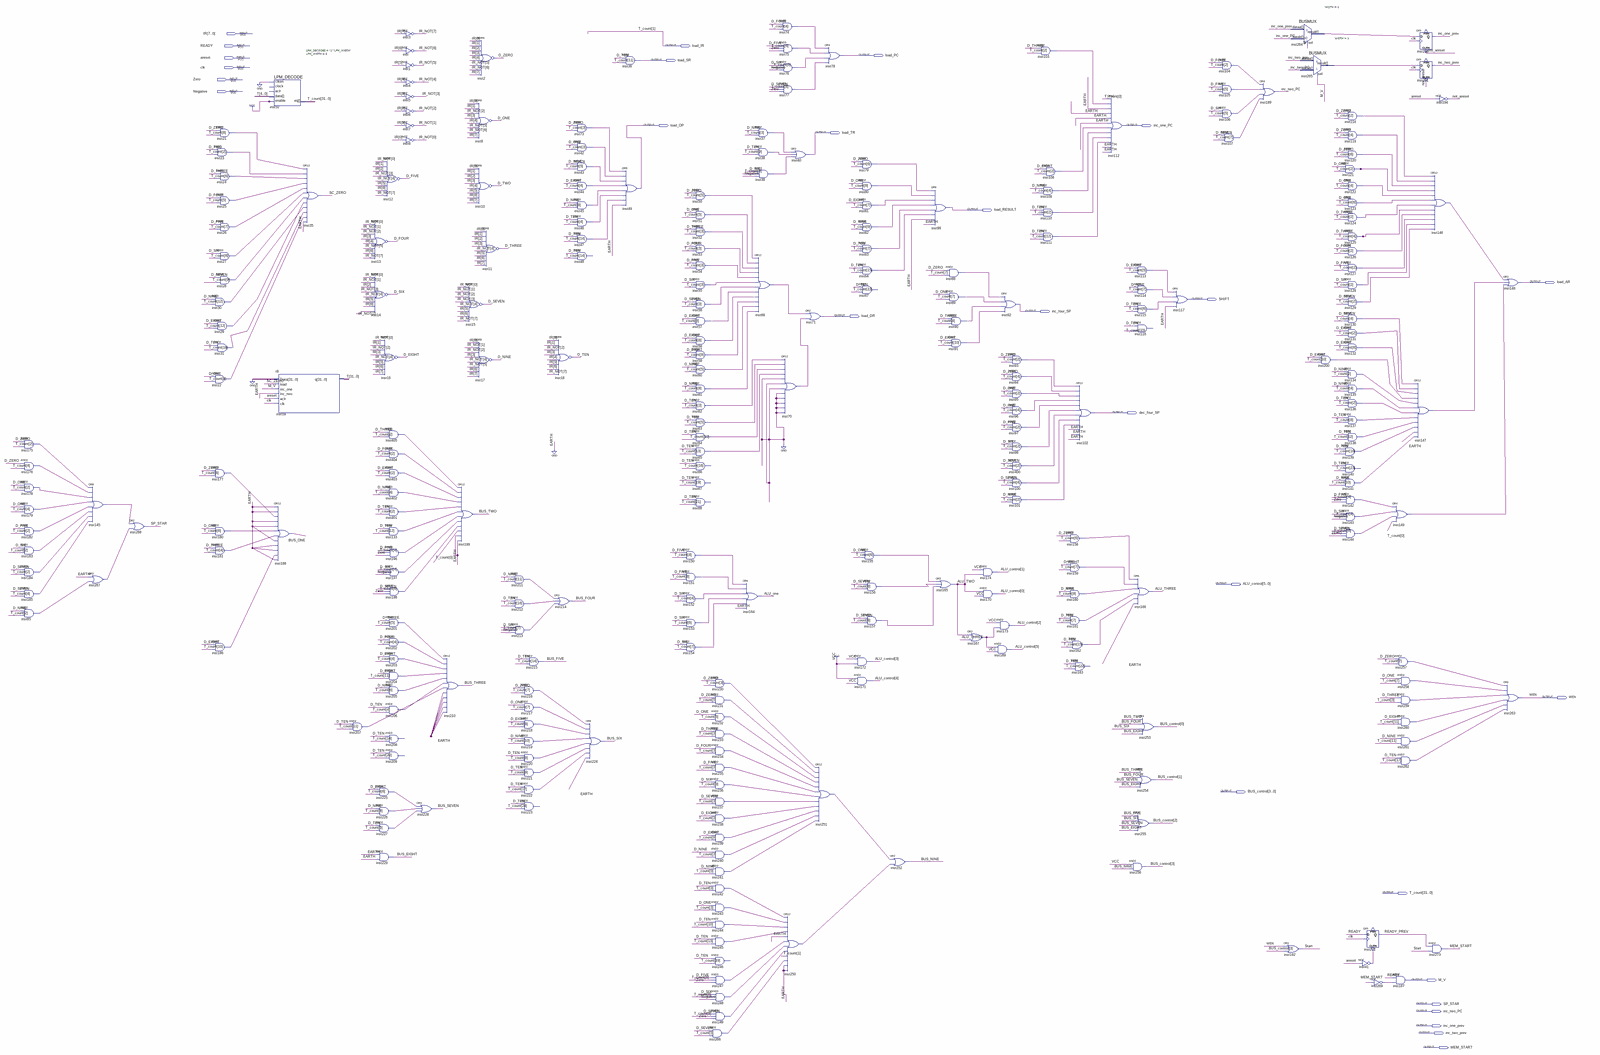
[diagram p0: schematic sheet, whole]
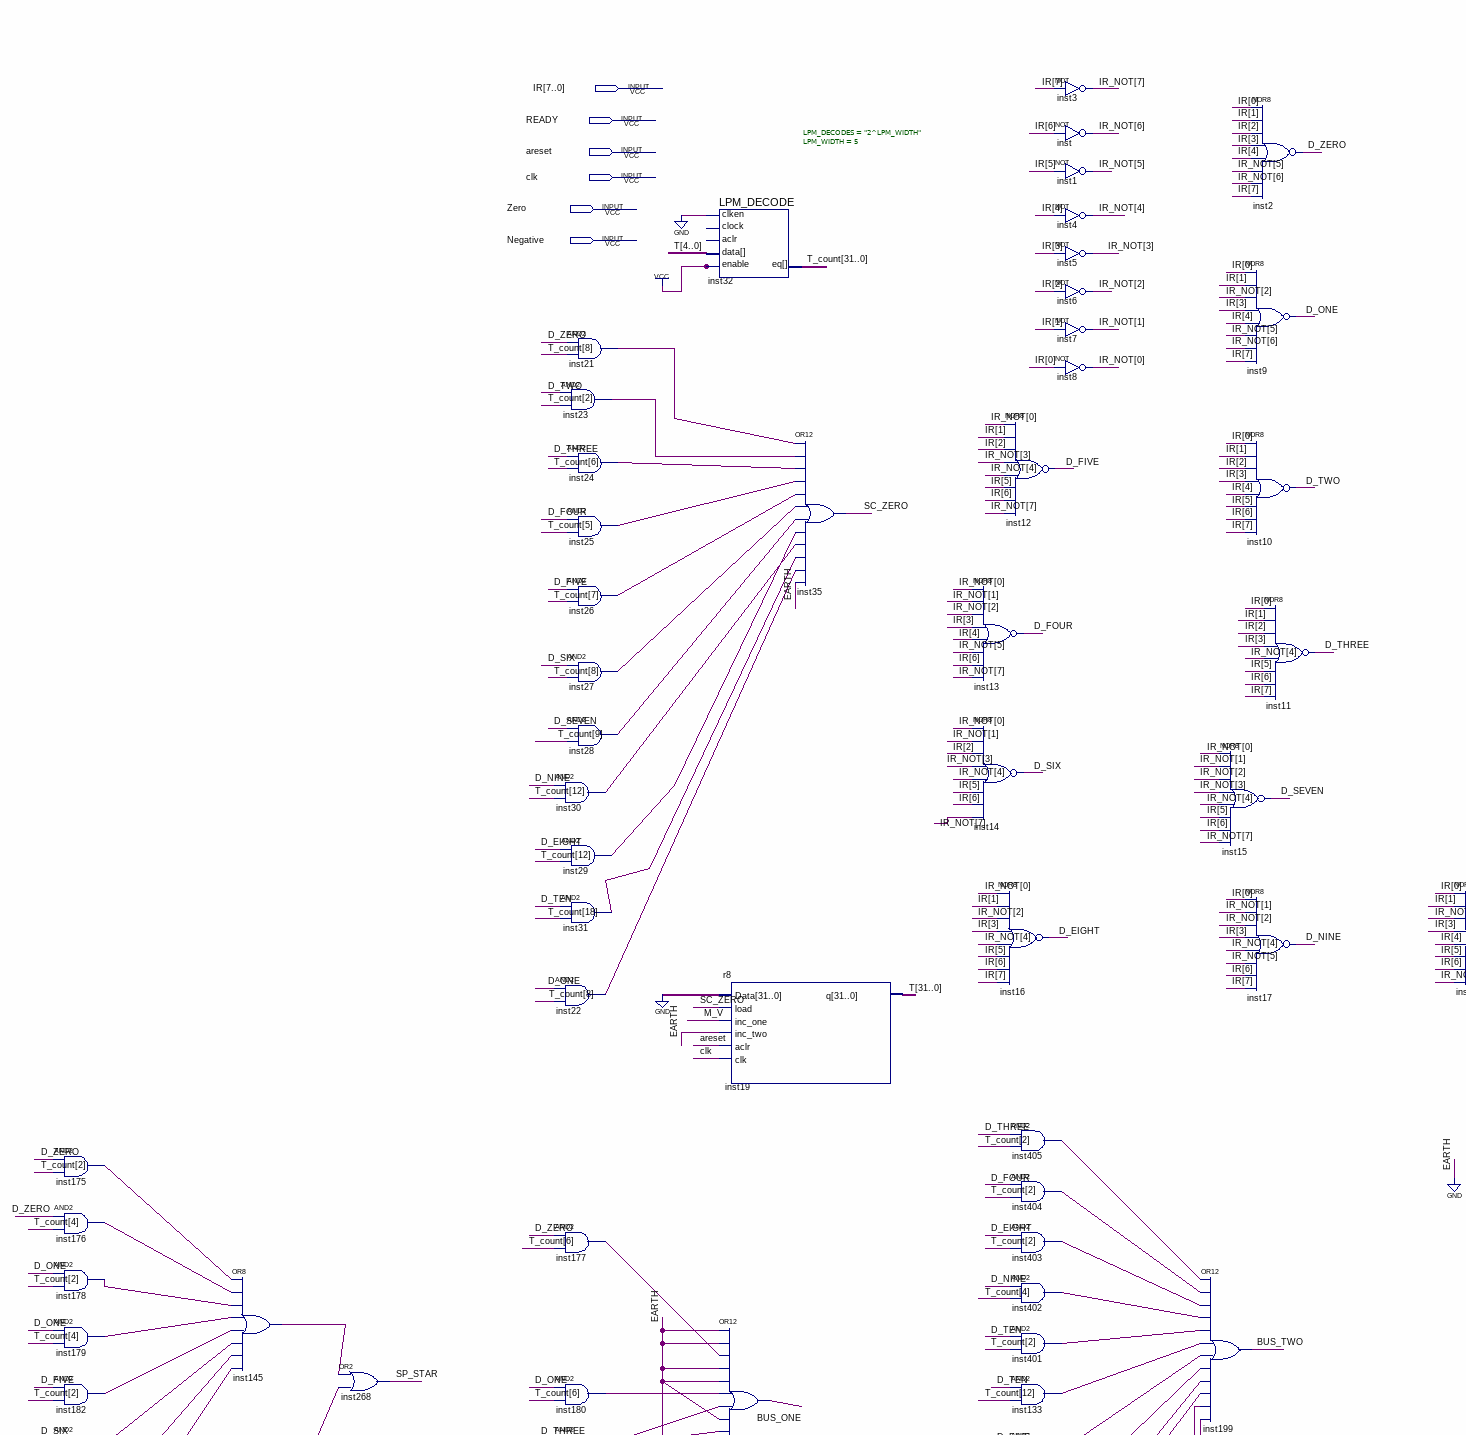
[diagram p1: schematic sheet, upper left part]
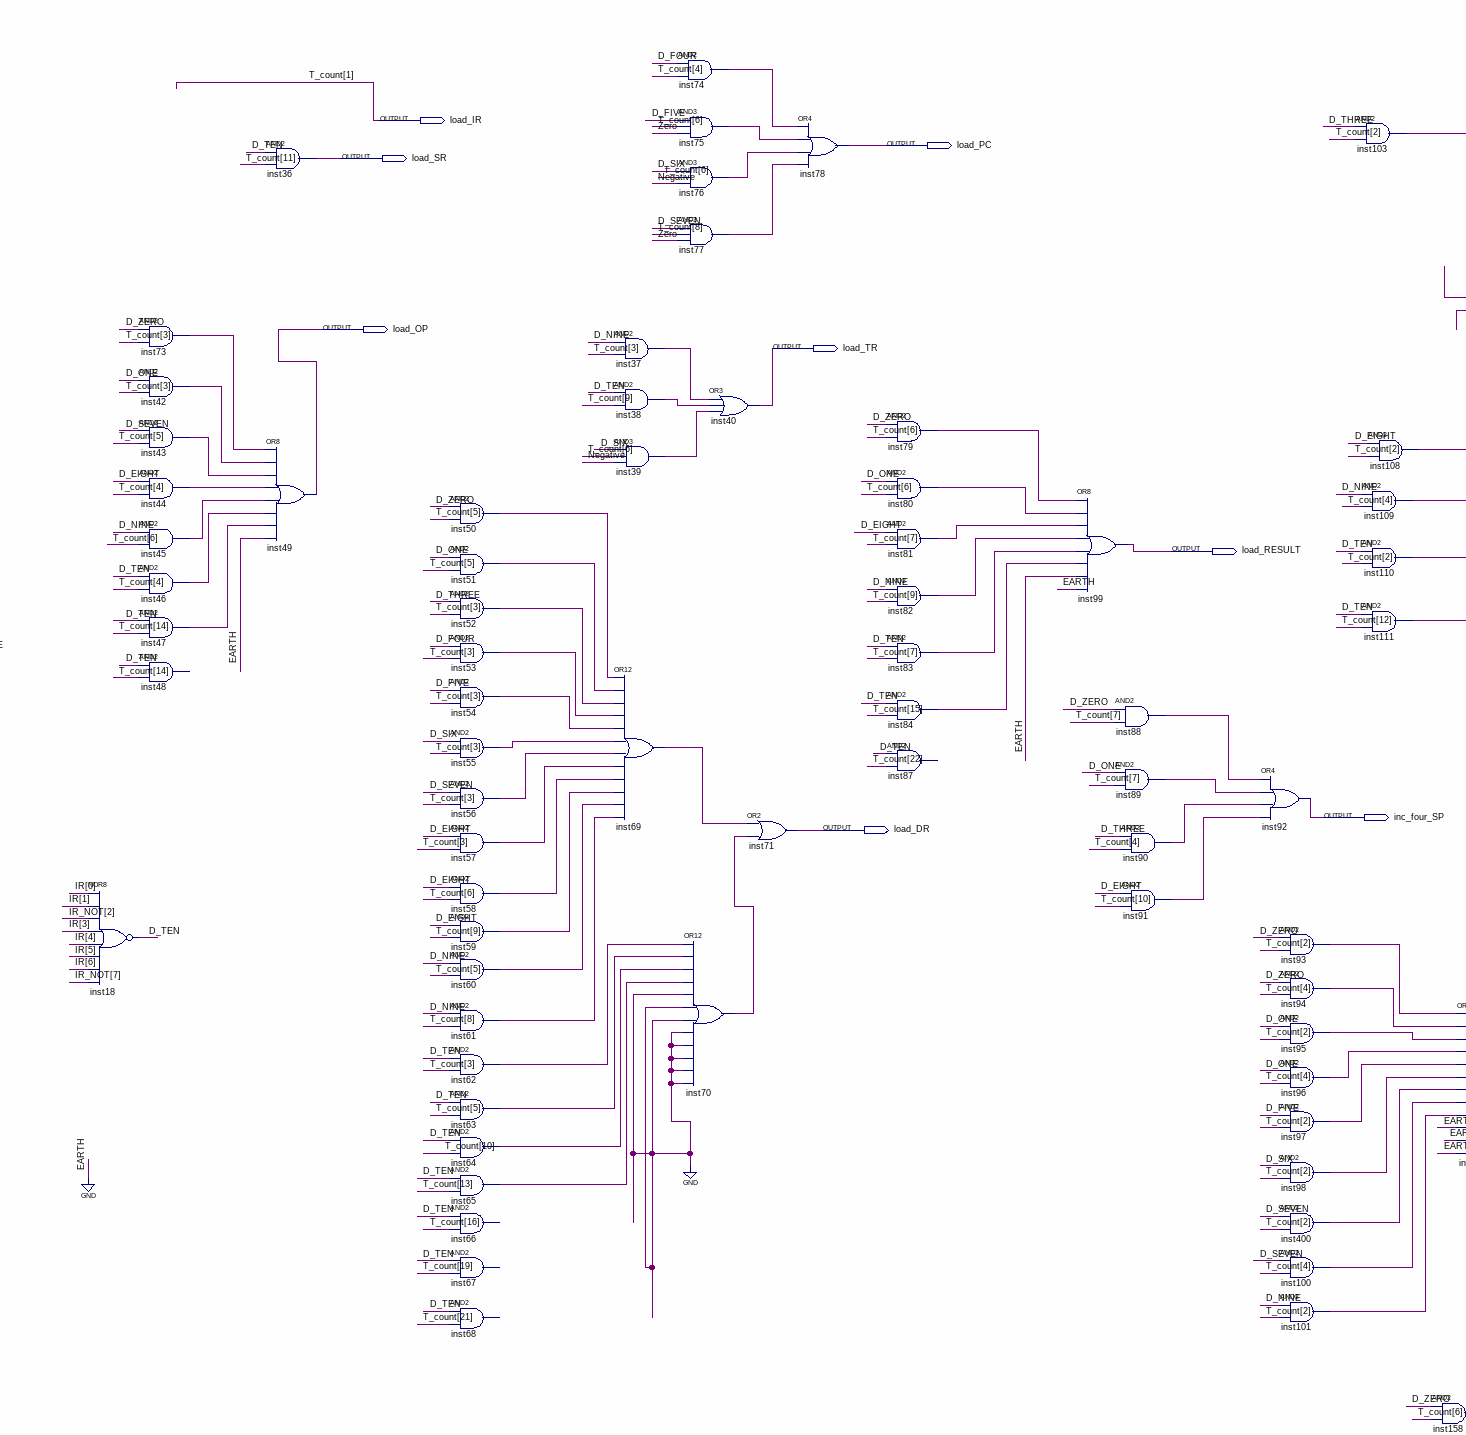
[diagram p2: schematic sheet, upper centre part]
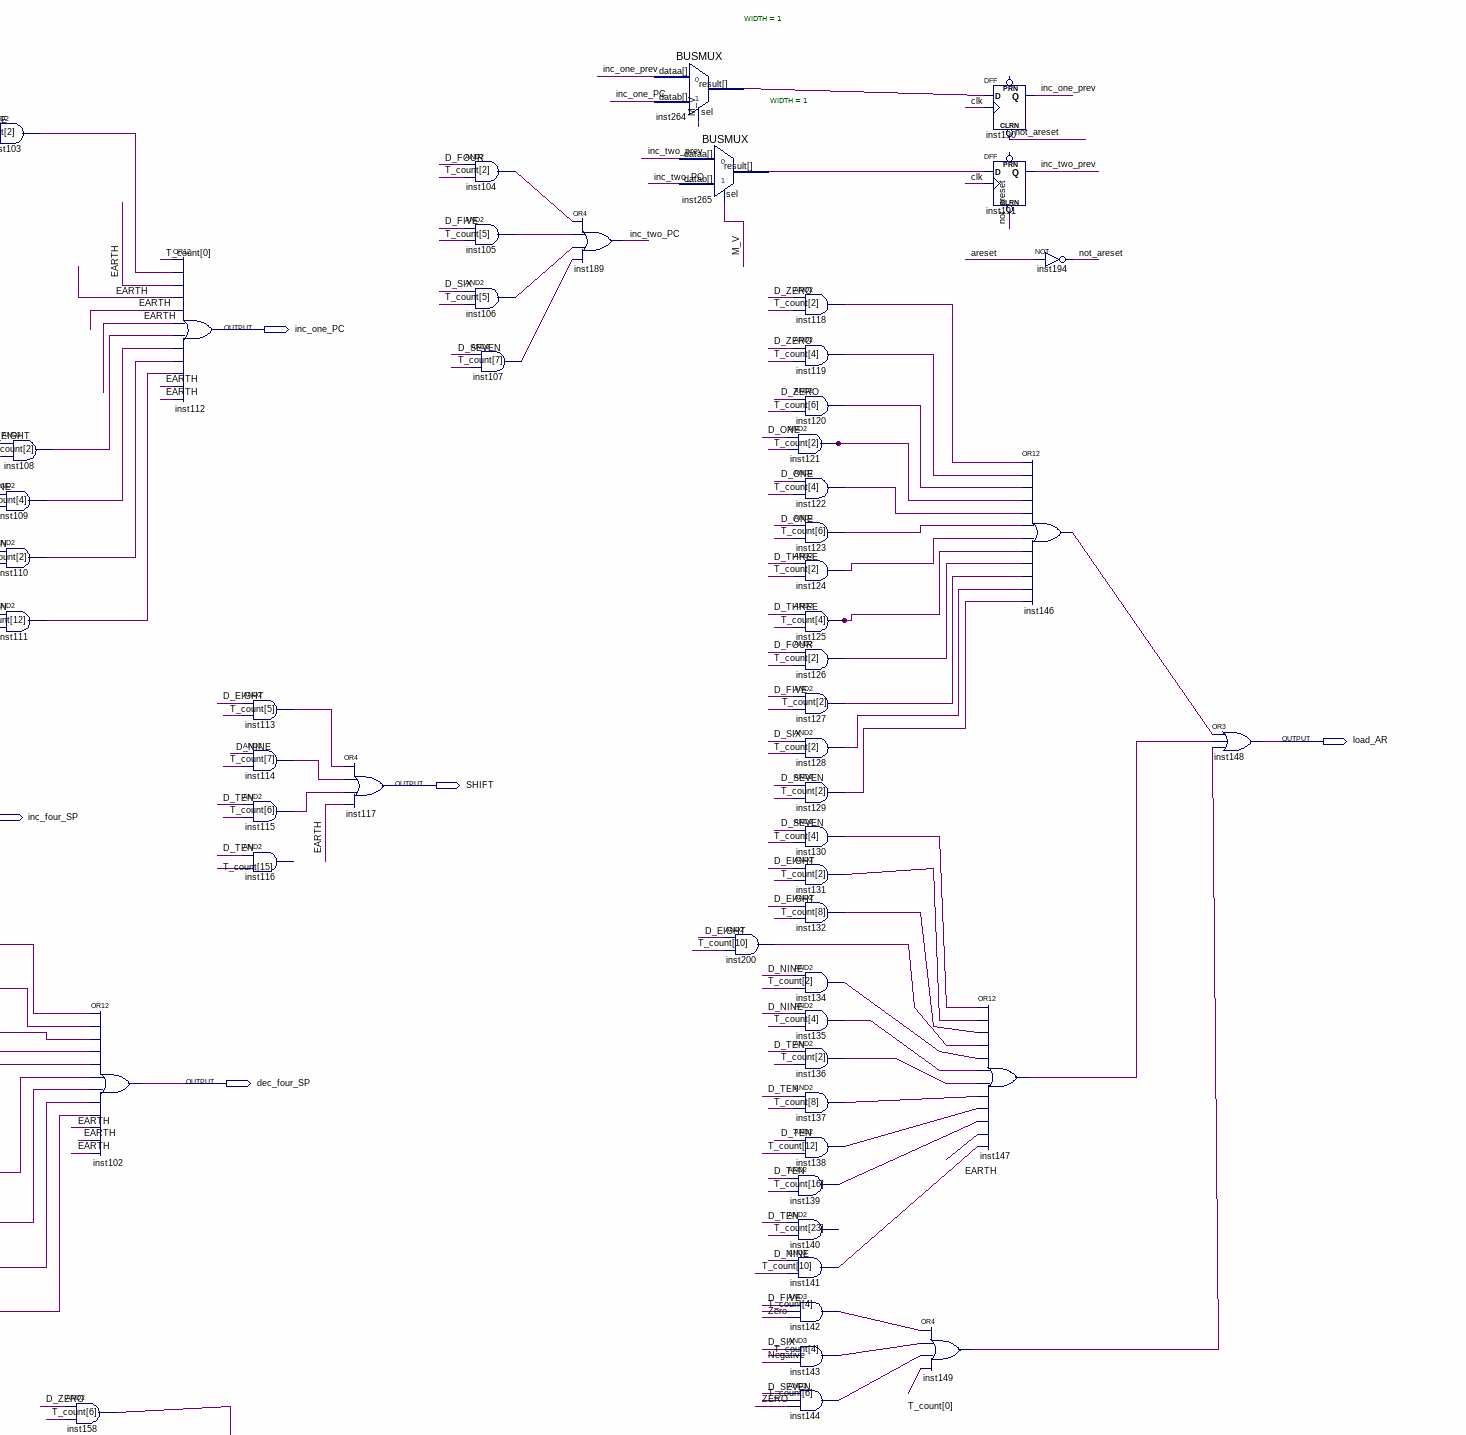
[diagram p3: schematic sheet, upper right part]
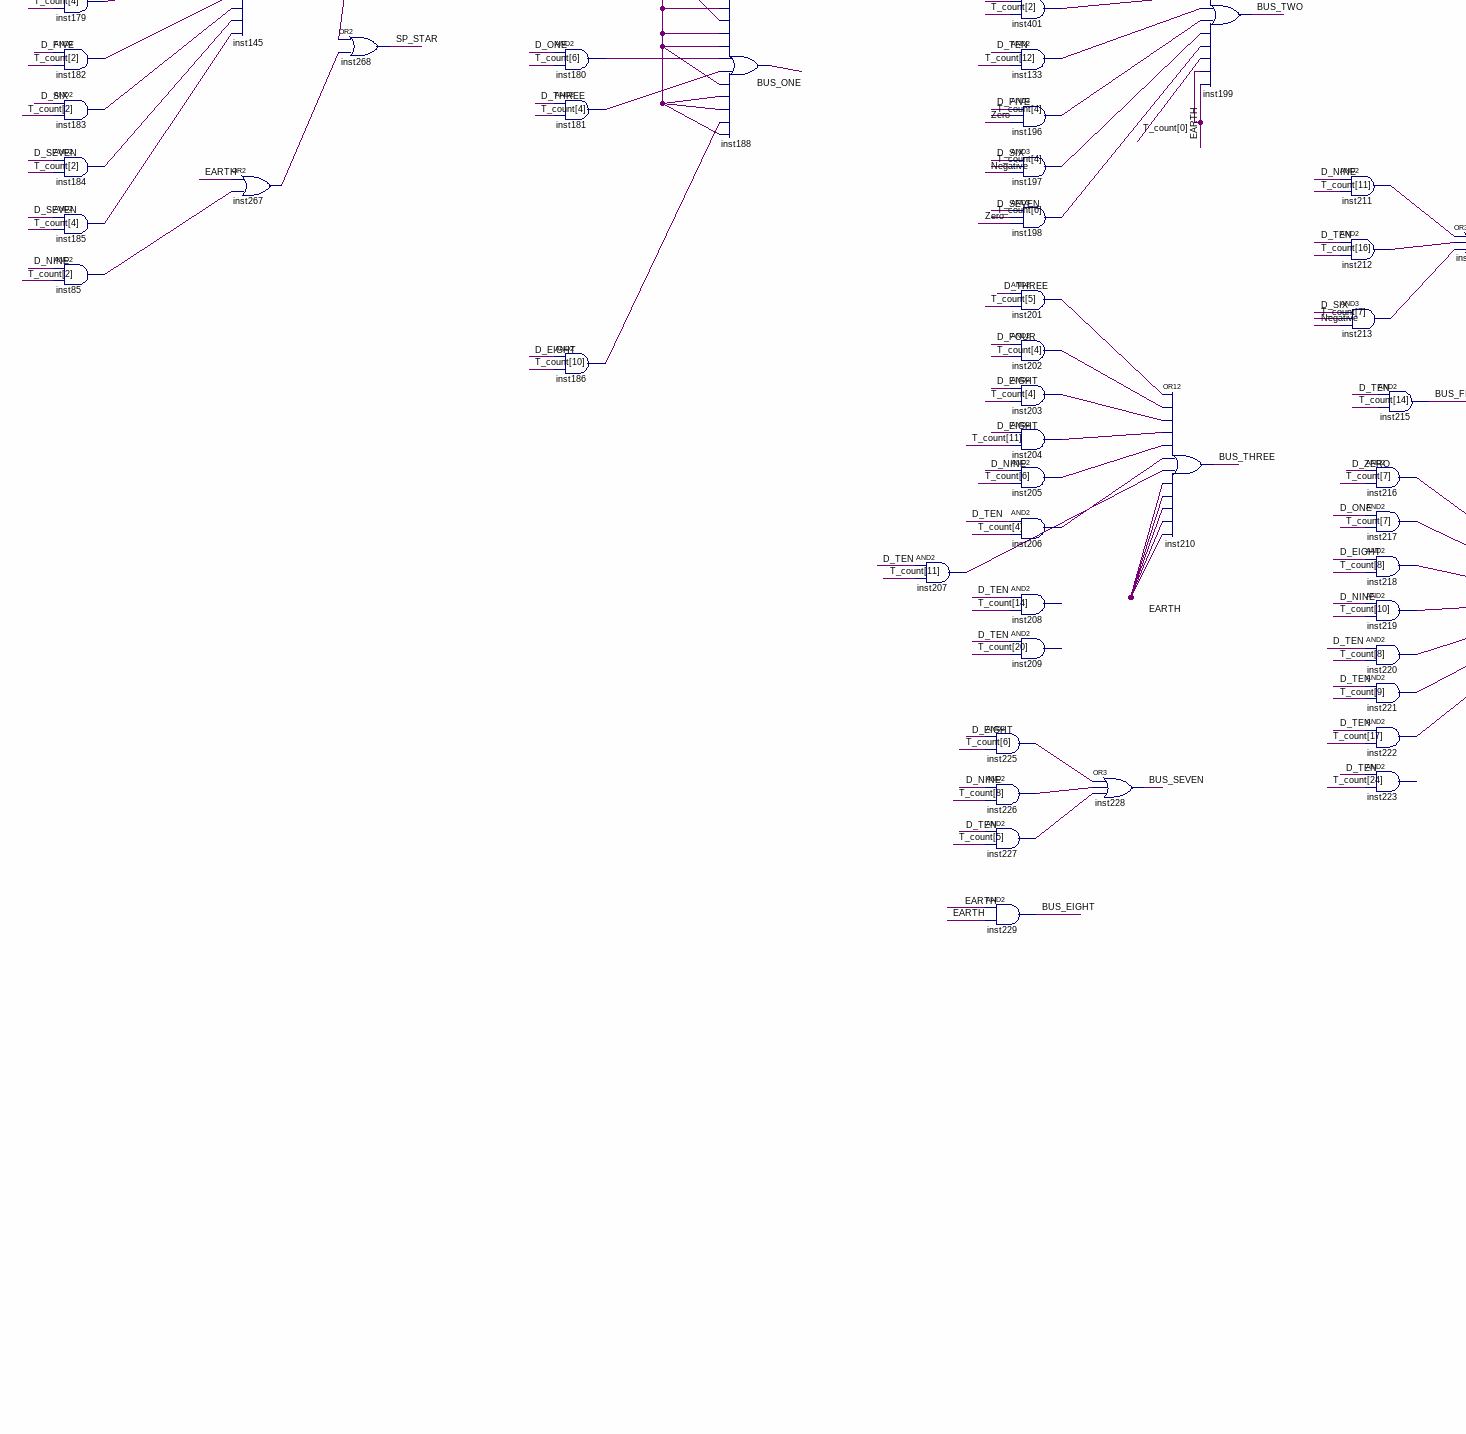
[diagram p4: schematic sheet, lower left part]
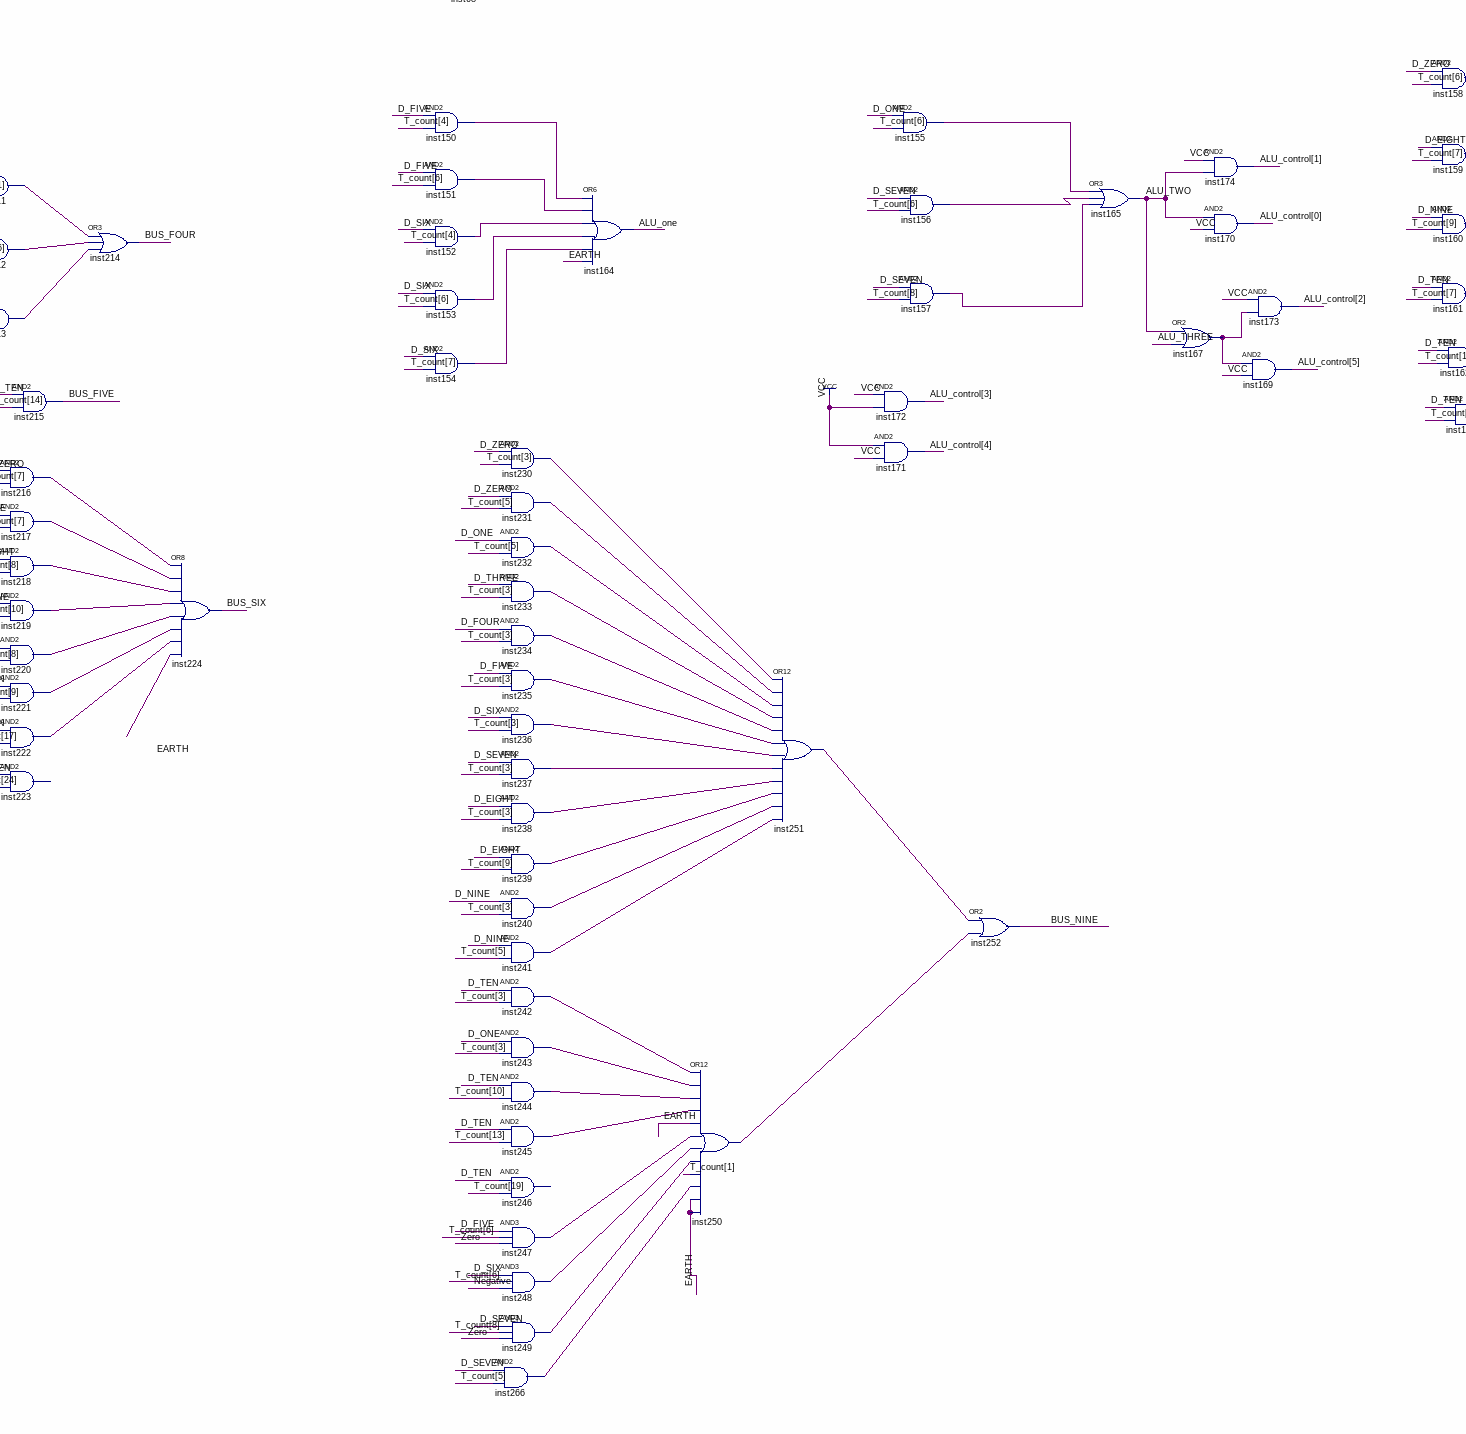
[diagram p5: schematic sheet, lower centre part]
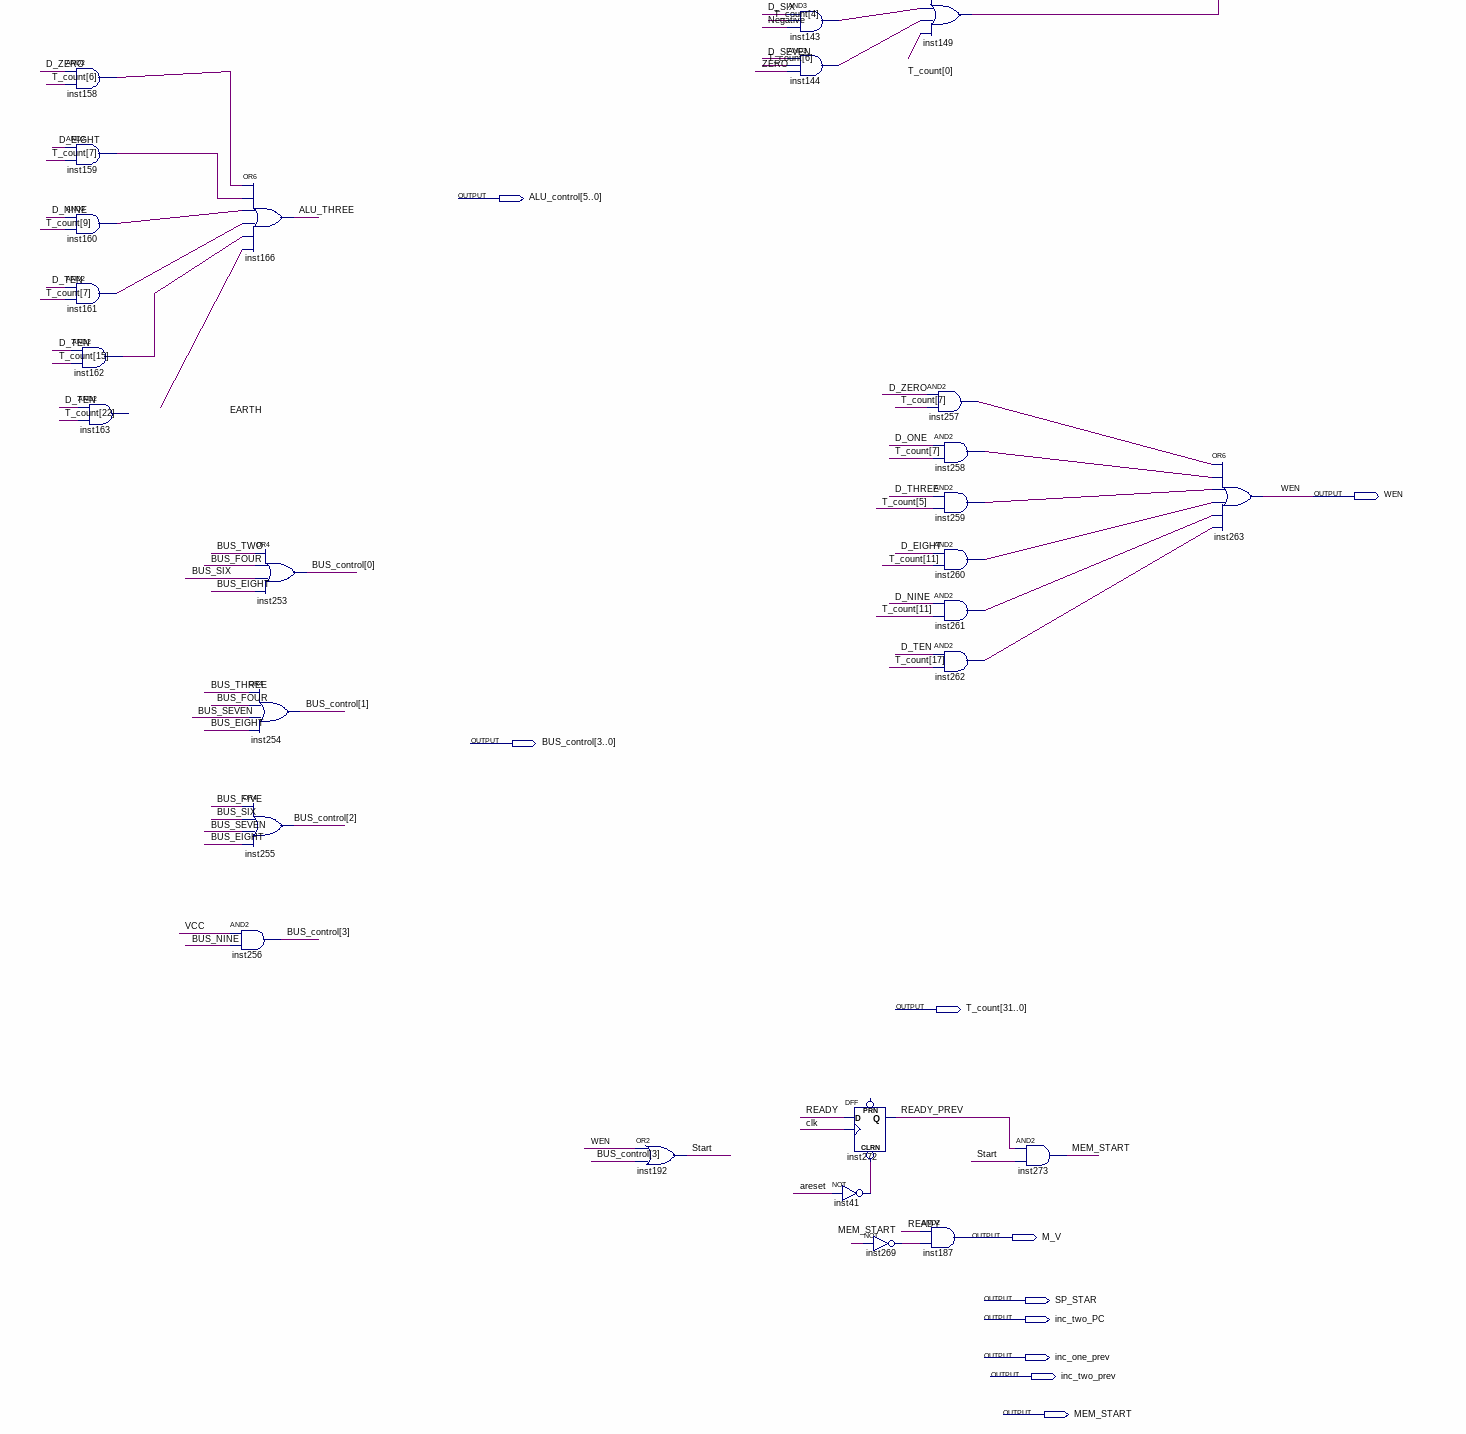
[diagram p6: schematic sheet, lower right part]
// Quartus schematic control.bdf as structural Verilog: 270 symbols, 28 pins
module control (
  input  [7:0] IR,
  input  READY,
  input  areset,
  input  clk,
  input  Zero,
  input  Negative,
  output load_IR,
  output load_PC,
  output load_SR,
  output load_OP,
  output inc_one_PC,
  output load_TR,
  output load_RESULT,
  output load_AR,
  output SHIFT,
  output inc_four_SP,
  output load_DR,
  output dec_four_SP,
  output [5:0] ALU_control,
  output WEN,
  output [3:0] BUS_control,
  output [31:0] T_count,
  output M_V,
  output SP_STAR,
  output inc_two_PC,
  output inc_one_prev,
  output inc_two_prev,
  output MEM_START
);

  wire ALU_one, ALU_THREE, ALU_TWO, BUS_EIGHT, BUS_FIVE, BUS_FOUR, BUS_NINE, BUS_ONE, BUS_SEVEN, BUS_SIX,
       BUS_THREE, BUS_TWO, D_EIGHT, D_FIVE, D_FOUR, D_NINE, D_ONE, D_SEVEN, D_SIX, D_TEN, D_THREE, D_TWO,
       D_ZERO, inst21_out, inst22_out, inst23_out, inst24_out, inst25_out, inst26_out, inst27_out,
       inst28_out, inst29_out, inst30_out, inst31_out, inst37_out, inst38_out, inst39_out, inst41_out,
       inst42_out, inst43_out, inst44_out, inst45_out, inst46_out, inst47_out, inst50_out, inst51_out,
       inst52_out, inst53_out, inst54_out, inst55_out, inst56_out, inst57_out, inst58_out, inst59_out,
       inst60_out, inst61_out, inst62_out, inst63_out, inst64_out, inst65_out, inst69_out, inst70_out,
       inst73_out, inst74_out, inst75_out, inst76_out, inst77_out, inst79_out, inst80_out, inst81_out,
       inst82_out, inst83_out, inst84_out, inst85_out, inst88_out, inst89_out, inst90_out, inst91_out,
       inst93_out, inst94_out, inst95_out, inst96_out, inst97_out, inst98_out, inst100_out, inst101_out,
       inst103_out, inst104_out, inst105_out, inst106_out, inst107_out, inst108_out, inst109_out,
       inst110_out, inst111_out, inst113_out, inst114_out, inst115_out, inst118_out, inst119_out,
       inst120_out, inst121_out, inst122_out, inst123_out, inst124_out, inst125_out, inst126_out,
       inst127_out, inst128_out, inst129_out, inst130_out, inst131_out, inst132_out, inst133_out,
       inst134_out, inst135_out, inst136_out, inst137_out, inst138_out, inst139_out, inst141_out,
       inst142_out, inst143_out, inst144_out, inst145_out, inst146_out, inst147_out, inst149_out,
       inst150_out, inst151_out, inst152_out, inst153_out, inst154_out, inst155_out, inst156_out,
       inst157_out, inst158_out, inst159_out, inst160_out, inst161_out, inst162_out, inst167_out,
       inst175_out, inst176_out, inst177_out, inst178_out, inst179_out, inst180_out, inst181_out,
       inst182_out, inst183_out, inst184_out, inst185_out, inst186_out, inst196_out, inst197_out,
       inst198_out, inst200_out, inst201_out, inst202_out, inst203_out, inst204_out, inst205_out,
       inst206_out, inst207_out, inst211_out, inst212_out, inst213_out, inst216_out, inst217_out,
       inst218_out, inst219_out, inst220_out, inst221_out, inst222_out, inst225_out, inst226_out,
       inst227_out, inst230_out, inst231_out, inst232_out, inst233_out, inst234_out, inst235_out,
       inst236_out, inst237_out, inst238_out, inst239_out, inst240_out, inst241_out, inst242_out,
       inst243_out, inst244_out, inst245_out, inst247_out, inst248_out, inst249_out, inst250_out,
       inst251_out, inst257_out, inst258_out, inst259_out, inst260_out, inst261_out, inst262_out,
       inst264_result, inst265_result, inst266_out, inst267_out, inst269_out, inst400_out, inst401_out,
       inst402_out, inst403_out, inst404_out, inst405_out, not_areset, READY_PREV, SC_ZERO, Start;
  wire [7:0] IR_NOT;
  wire [31:0] T;

  and inst175 (inst175_out, D_ZERO, T_count[2]);
  and inst176 (inst176_out, D_ZERO, T_count[4]);
  and inst178 (inst178_out, D_ONE, T_count[2]);
  and inst179 (inst179_out, D_ONE, T_count[4]);
  and inst182 (inst182_out, D_FIVE, T_count[2]);
  and inst183 (inst183_out, D_SIX, T_count[2]);
  and inst184 (inst184_out, D_SEVEN, T_count[2]);
  and inst185 (inst185_out, D_SEVEN, T_count[4]);
  and inst85 (inst85_out, D_NINE, T_count[2]);
  or inst145 (inst145_out, inst175_out, inst176_out, inst178_out, inst179_out, inst182_out, inst183_out, inst184_out, inst185_out);
  or inst267 (inst267_out, 1'b0, inst85_out);
  or inst268 (SP_STAR, inst145_out, inst267_out);
  and inst21 (inst21_out, D_ZERO, T_count[8]);
  and inst23 (inst23_out, D_TWO, T_count[2]);
  and inst24 (inst24_out, D_THREE, T_count[6]);
  and inst25 (inst25_out, D_FOUR, T_count[5]);
  and inst26 (inst26_out, D_FIVE, T_count[7]);
  and inst27 (inst27_out, D_SIX, T_count[8]);
  and inst28 (inst28_out, D_SEVEN, T_count[9]);
  and inst30 (inst30_out, D_NINE, T_count[12]);
  and inst29 (inst29_out, D_EIGHT, T_count[12]);
  and inst31 (inst31_out, D_TEN, T_count[18]);
  and inst22 (inst22_out, D_ONE, T_count[8]);
  and inst177 (inst177_out, D_ZERO, T_count[6]);
  and inst180 (inst180_out, D_ONE, T_count[6]);
  and inst181 (inst181_out, D_THREE, T_count[4]);
  and inst186 (inst186_out, D_EIGHT, T_count[10]);
  LPM_DECODE #(.LPM_DECODES("2^LPM_WIDTH"), .LPM_WIDTH(5)) inst32 (
    .enable(1'b1), .data(T[4:0]), .clken(1'b0), .eq({T_count[31:2], load_IR, T_count[0]}));  // open: clock, aclr
  r8 inst19 (.Data({32{1'b0}}), .load(SC_ZERO), .inc_one(M_V), .inc_two(1'b0), .aclr(areset), .clk(clk), .q(T));
  or inst188 (BUS_ONE, 1'b0, 1'b0, inst177_out, 1'b0, 1'b0, inst180_out, inst181_out, 1'b0, 1'b0, 1'b0, inst186_out, 1'b0);
  or inst35 (SC_ZERO, inst21_out, inst23_out, inst24_out, inst25_out, inst26_out, inst27_out, inst28_out, inst29_out, inst30_out, inst31_out, inst22_out, 1'b0);
  and inst207 (inst207_out, D_TEN, T_count[11]);
  nor inst13 (D_FOUR, IR_NOT[0], IR_NOT[1], IR_NOT[2], IR[3], IR[4], IR_NOT[5], IR[6], IR_NOT[7]);
  nor inst14 (D_SIX, IR_NOT[0], IR_NOT[1], IR[2], IR_NOT[3], IR_NOT[4], IR[5], IR[6], IR_NOT[7]);
  nor inst16 (D_EIGHT, IR_NOT[0], IR[1], IR_NOT[2], IR[3], IR_NOT[4], IR[5], IR[6], IR[7]);
  and inst225 (inst225_out, D_EIGHT, T_count[6]);
  and inst226 (inst226_out, D_NINE, T_count[8]);
  and inst227 (inst227_out, D_TEN, T_count[5]);
  and inst229 (BUS_EIGHT, 1'b0, 1'b0);
  nor inst12 (D_FIVE, IR_NOT[0], IR[1], IR[2], IR_NOT[3], IR_NOT[4], IR[5], IR[6], IR_NOT[7]);
  and inst405 (inst405_out, D_THREE, T_count[2]);
  and inst404 (inst404_out, D_FOUR, T_count[2]);
  and inst403 (inst403_out, D_EIGHT, T_count[2]);
  and inst402 (inst402_out, D_NINE, T_count[4]);
  and inst401 (inst401_out, D_TEN, T_count[2]);
  and inst133 (inst133_out, D_TEN, T_count[12]);
  and inst196 (inst196_out, D_FIVE, T_count[4], Zero);
  and inst197 (inst197_out, D_SIX, T_count[4], Negative);
  and inst198 (inst198_out, D_SEVEN, T_count[6], Zero);
  and inst201 (inst201_out, D_THREE, T_count[5]);
  and inst202 (inst202_out, D_FOUR, T_count[4]);
  and inst203 (inst203_out, D_EIGHT, T_count[4]);
  and inst204 (inst204_out, D_EIGHT, T_count[11]);
  and inst205 (inst205_out, D_NINE, T_count[6]);
  and inst206 (inst206_out, D_TEN, T_count[4]);
  // AND2 inst208 has open pins: IN1=D_TEN, IN2=T_count[14], OUT=open
  // AND2 inst209 has open pins: IN1=D_TEN, IN2=T_count[20], OUT=open
  not inst3 (IR_NOT[7], IR[7]);
  not inst (IR_NOT[6], IR[6]);
  not inst1 (IR_NOT[5], IR[5]);
  not inst4 (IR_NOT[4], IR[4]);
  not inst5 (IR_NOT[3], IR[3]);
  not inst6 (IR_NOT[2], IR[2]);
  not inst7 (IR_NOT[1], IR[1]);
  not inst8 (IR_NOT[0], IR[0]);
  or inst228 (BUS_SEVEN, inst225_out, inst226_out, inst227_out);
  or inst199 (BUS_TWO, inst405_out, inst404_out, inst403_out, inst402_out, inst401_out, inst133_out, inst196_out, inst197_out, inst198_out, T_count[0], 1'b0, 1'b0);
  or inst210 (BUS_THREE, inst201_out, inst202_out, inst203_out, inst204_out, inst205_out, inst206_out, inst207_out, 1'b0, 1'b0, 1'b0, 1'b0, 1'b0);
  nor inst2 (D_ZERO, IR[0], IR[1], IR[2], IR[3], IR[4], IR_NOT[5], IR_NOT[6], IR[7]);
  nor inst9 (D_ONE, IR[0], IR[1], IR_NOT[2], IR[3], IR[4], IR_NOT[5], IR_NOT[6], IR[7]);
  nor inst10 (D_TWO, IR[0], IR[1], IR[2], IR[3], IR[4], IR[5], IR[6], IR[7]);
  nor inst15 (D_SEVEN, IR_NOT[0], IR_NOT[1], IR_NOT[2], IR_NOT[3], IR_NOT[4], IR[5], IR[6], IR_NOT[7]);
  nor inst17 (D_NINE, IR[0], IR_NOT[1], IR_NOT[2], IR[3], IR_NOT[4], IR_NOT[5], IR[6], IR[7]);
  nor inst11 (D_THREE, IR[0], IR[1], IR[2], IR[3], IR_NOT[4], IR[5], IR[6], IR[7]);
  and inst211 (inst211_out, D_NINE, T_count[11]);
  and inst212 (inst212_out, D_TEN, T_count[16]);
  and inst213 (inst213_out, D_SIX, T_count[7], Negative);
  and inst215 (BUS_FIVE, D_TEN, T_count[14]);
  and inst216 (inst216_out, D_ZERO, T_count[7]);
  and inst217 (inst217_out, D_ONE, T_count[7]);
  and inst218 (inst218_out, D_EIGHT, T_count[8]);
  and inst219 (inst219_out, D_NINE, T_count[10]);
  and inst220 (inst220_out, D_TEN, T_count[8]);
  and inst221 (inst221_out, D_TEN, T_count[9]);
  and inst222 (inst222_out, D_TEN, T_count[17]);
  // AND2 inst223 has open pins: IN1=D_TEN, IN2=T_count[24], OUT=open
  nor inst18 (D_TEN, IR[0], IR[1], IR_NOT[2], IR[3], IR[4], IR[5], IR[6], IR_NOT[7]);
  or inst214 (BUS_FOUR, inst211_out, inst212_out, inst213_out);
  and inst73 (inst73_out, D_ZERO, T_count[3]);
  and inst42 (inst42_out, D_ONE, T_count[3]);
  and inst43 (inst43_out, D_SEVEN, T_count[5]);
  and inst44 (inst44_out, D_EIGHT, T_count[4]);
  and inst45 (inst45_out, D_NINE, T_count[6]);
  and inst46 (inst46_out, D_TEN, T_count[4]);
  and inst47 (inst47_out, D_TEN, T_count[14]);
  // AND2 inst48 has open pins: IN1=D_TEN, IN2=T_count[14], OUT=open
  or inst224 (BUS_SIX, inst216_out, inst217_out, inst218_out, inst219_out, inst220_out, inst221_out, inst222_out, 1'b0);
  and inst36 (load_SR, D_TEN, T_count[11]);
  or inst49 (load_OP, inst73_out, inst42_out, inst43_out, inst44_out, inst45_out, inst46_out, inst47_out, 1'b0);
  and inst150 (inst150_out, D_FIVE, T_count[4]);
  and inst151 (inst151_out, D_FIVE, T_count[6]);
  and inst152 (inst152_out, D_SIX, T_count[4]);
  and inst153 (inst153_out, D_SIX, T_count[6]);
  and inst154 (inst154_out, D_SIX, T_count[7]);
  and inst50 (inst50_out, D_ZERO, T_count[5]);
  and inst51 (inst51_out, D_ONE, T_count[5]);
  and inst52 (inst52_out, D_THREE, T_count[3]);
  and inst53 (inst53_out, D_FOUR, T_count[3]);
  and inst54 (inst54_out, D_FIVE, T_count[3]);
  and inst55 (inst55_out, D_SIX, T_count[3]);
  and inst56 (inst56_out, D_SEVEN, T_count[3]);
  and inst57 (inst57_out, D_EIGHT, T_count[3]);
  and inst58 (inst58_out, D_EIGHT, T_count[6]);
  and inst59 (inst59_out, D_EIGHT, T_count[9]);
  and inst60 (inst60_out, D_NINE, T_count[5]);
  and inst61 (inst61_out, D_NINE, T_count[8]);
  and inst62 (inst62_out, D_TEN, T_count[3]);
  and inst63 (inst63_out, D_TEN, T_count[5]);
  and inst64 (inst64_out, D_TEN, T_count[10]);
  and inst65 (inst65_out, D_TEN, T_count[13]);
  // AND2 inst66 has open pins: IN1=D_TEN, IN2=T_count[16], OUT=open
  // AND2 inst67 has open pins: IN1=D_TEN, IN2=T_count[19], OUT=open
  // AND2 inst68 has open pins: IN1=D_TEN, IN2=T_count[21], OUT=open
  and inst266 (inst266_out, D_SEVEN, T_count[5]);
  and inst230 (inst230_out, D_ZERO, T_count[3]);
  and inst231 (inst231_out, D_ZERO, T_count[5]);
  and inst232 (inst232_out, D_ONE, T_count[5]);
  and inst233 (inst233_out, D_THREE, T_count[3]);
  and inst234 (inst234_out, D_FOUR, T_count[3]);
  and inst235 (inst235_out, D_FIVE, T_count[3]);
  and inst236 (inst236_out, D_SIX, T_count[3]);
  and inst237 (inst237_out, D_SEVEN, T_count[3]);
  and inst238 (inst238_out, D_EIGHT, T_count[3]);
  and inst239 (inst239_out, D_EIGHT, T_count[9]);
  and inst240 (inst240_out, D_NINE, T_count[3]);
  and inst241 (inst241_out, D_NINE, T_count[5]);
  and inst242 (inst242_out, D_TEN, T_count[3]);
  and inst243 (inst243_out, D_ONE, T_count[3]);
  and inst244 (inst244_out, D_TEN, T_count[10]);
  and inst245 (inst245_out, D_TEN, T_count[13]);
  // AND2 inst246 has open pins: IN1=D_TEN, IN2=T_count[19], OUT=open
  and inst247 (inst247_out, D_FIVE, T_count[6], Zero);
  and inst248 (inst248_out, D_SIX, T_count[6], Negative);
  and inst249 (inst249_out, D_SEVEN, T_count[8], Zero);
  or inst164 (ALU_one, inst150_out, inst151_out, inst152_out, inst153_out, inst154_out, 1'b0);
  and inst37 (inst37_out, D_NINE, T_count[3]);
  and inst38 (inst38_out, D_TEN, T_count[9]);
  and inst39 (inst39_out, D_SIX, T_count[6], Negative);
  or inst69 (inst69_out, inst50_out, inst51_out, inst52_out, inst53_out, inst54_out, inst55_out, inst56_out, inst57_out, inst58_out, inst59_out, inst60_out, inst61_out);
  and inst74 (inst74_out, D_FOUR, T_count[4]);
  and inst75 (inst75_out, D_FIVE, T_count[6], Zero);
  and inst76 (inst76_out, D_SIX, T_count[6], Negative);
  and inst77 (inst77_out, D_SEVEN, T_count[8], Zero);
  or inst70 (inst70_out, inst62_out, inst63_out, inst64_out, inst65_out, 1'b0, 1'b0, 1'b0, 1'b0, 1'b0, 1'b0, 1'b0, 1'b0);
  or inst250 (inst250_out, inst242_out, inst243_out, inst244_out, inst245_out, 1'b0, inst247_out, inst248_out, inst249_out, load_IR, inst266_out, 1'b0, 1'b0);
  or inst40 (load_TR, inst37_out, inst38_out, inst39_out);
  or inst71 (load_DR, inst69_out, inst70_out);
  or inst78 (load_PC, inst74_out, inst75_out, inst76_out, inst77_out);
  or inst251 (inst251_out, inst230_out, inst231_out, inst232_out, inst233_out, inst234_out, inst235_out, inst236_out, inst237_out, inst238_out, inst239_out, inst240_out, inst241_out);
  and inst79 (inst79_out, D_ZERO, T_count[6]);
  and inst80 (inst80_out, D_ONE, T_count[6]);
  and inst81 (inst81_out, D_EIGHT, T_count[7]);
  and inst82 (inst82_out, D_NINE, T_count[9]);
  and inst83 (inst83_out, D_TEN, T_count[7]);
  and inst84 (inst84_out, D_TEN, T_count[15]);
  // AND2 inst87 has open pins: IN1=D_TEN, IN2=T_count[22], OUT=open
  and inst155 (inst155_out, D_ONE, T_count[6]);
  and inst156 (inst156_out, D_SEVEN, T_count[6]);
  and inst157 (inst157_out, D_SEVEN, T_count[8]);
  and inst172 (ALU_control[3], 1'b1, 1'b1);
  and inst171 (ALU_control[4], 1'b1, 1'b1);
  or inst252 (BUS_NINE, inst251_out, inst250_out);
  or inst99 (load_RESULT, inst79_out, inst80_out, inst81_out, inst82_out, inst83_out, inst84_out, 1'b0, 1'b0);
  or inst165 (ALU_TWO, inst155_out, inst156_out, inst157_out);
  and inst88 (inst88_out, D_ZERO, T_count[7]);
  and inst89 (inst89_out, D_ONE, T_count[7]);
  and inst90 (inst90_out, D_THREE, T_count[4]);
  and inst91 (inst91_out, D_EIGHT, T_count[10]);
  and inst174 (ALU_control[1], 1'b1, ALU_TWO);
  and inst170 (ALU_control[0], ALU_TWO, 1'b1);
  or inst167 (inst167_out, ALU_TWO, ALU_THREE);
  and inst173 (ALU_control[2], 1'b1, inst167_out);
  and inst169 (ALU_control[5], inst167_out, 1'b1);
  or inst92 (inc_four_SP, inst88_out, inst89_out, inst90_out, inst91_out);
  and inst93 (inst93_out, D_ZERO, T_count[2]);
  and inst94 (inst94_out, D_ZERO, T_count[4]);
  and inst95 (inst95_out, D_ONE, T_count[2]);
  and inst96 (inst96_out, D_ONE, T_count[4]);
  and inst97 (inst97_out, D_FIVE, T_count[2]);
  and inst98 (inst98_out, D_SIX, T_count[2]);
  and inst400 (inst400_out, D_SEVEN, T_count[2]);
  and inst100 (inst100_out, D_SEVEN, T_count[4]);
  and inst101 (inst101_out, D_NINE, T_count[2]);
  and inst103 (inst103_out, D_THREE, T_count[2]);
  and inst108 (inst108_out, D_EIGHT, T_count[2]);
  and inst109 (inst109_out, D_NINE, T_count[4]);
  and inst110 (inst110_out, D_TEN, T_count[2]);
  and inst111 (inst111_out, D_TEN, T_count[12]);
  or inst102 (dec_four_SP, inst93_out, inst94_out, inst95_out, inst96_out, inst97_out, inst98_out, inst400_out, inst100_out, inst101_out, 1'b0, 1'b0, 1'b0);
  and inst158 (inst158_out, D_ZERO, T_count[6]);
  and inst159 (inst159_out, D_EIGHT, T_count[7]);
  and inst160 (inst160_out, D_NINE, T_count[9]);
  and inst161 (inst161_out, D_TEN, T_count[7]);
  and inst162 (inst162_out, D_TEN, T_count[15]);
  // AND2 inst163 has open pins: IN1=D_TEN, IN2=T_count[22], OUT=open
  or inst112 (inc_one_PC, T_count[0], inst103_out, 1'b0, 1'b0, 1'b0, 1'b0, inst108_out, inst109_out, inst110_out, inst111_out, 1'b0, 1'b0);
  and inst113 (inst113_out, D_EIGHT, T_count[5]);
  and inst114 (inst114_out, D_NINE, T_count[7]);
  and inst115 (inst115_out, D_TEN, T_count[6]);
  // AND2 inst116 has open pins: IN1=D_TEN, IN2=T_count[15], OUT=open
  or inst166 (ALU_THREE, inst158_out, inst159_out, inst160_out, inst161_out, inst162_out, 1'b0);
  or inst255 (BUS_control[2], BUS_FIVE, BUS_SIX, BUS_SEVEN, BUS_EIGHT);
  and inst256 (BUS_control[3], 1'b1, BUS_NINE);
  or inst253 (BUS_control[0], BUS_TWO, BUS_FOUR, BUS_SIX, BUS_EIGHT);
  or inst254 (BUS_control[1], BUS_THREE, BUS_FOUR, BUS_SEVEN, BUS_EIGHT);
  or inst117 (SHIFT, inst113_out, inst114_out, inst115_out, 1'b0);
  and inst104 (inst104_out, D_FOUR, T_count[2]);
  and inst105 (inst105_out, D_FIVE, T_count[5]);
  and inst106 (inst106_out, D_SIX, T_count[5]);
  and inst107 (inst107_out, D_SEVEN, T_count[7]);
  or inst189 (inc_two_PC, inst104_out, inst105_out, inst106_out, inst107_out);
  or inst192 (Start, WEN, BUS_control[3]);
  BUSMUX #(.WIDTH(1)) inst264 (.datab(inc_one_PC), .sel(M_V), .dataa(inc_one_prev), .result(inst264_result));
  BUSMUX #(.WIDTH(1)) inst265 (.datab(inc_two_PC), .sel(M_V), .dataa(inc_two_prev), .result(inst265_result));
  and inst200 (inst200_out, D_EIGHT, T_count[10]);
  and inst118 (inst118_out, D_ZERO, T_count[2]);
  and inst119 (inst119_out, D_ZERO, T_count[4]);
  and inst120 (inst120_out, D_ZERO, T_count[6]);
  and inst121 (inst121_out, D_ONE, T_count[2]);
  and inst122 (inst122_out, D_ONE, T_count[4]);
  and inst123 (inst123_out, D_ONE, T_count[6]);
  and inst124 (inst124_out, D_THREE, T_count[2]);
  and inst125 (inst125_out, D_THREE, T_count[4]);
  and inst126 (inst126_out, D_FOUR, T_count[2]);
  and inst127 (inst127_out, D_FIVE, T_count[2]);
  and inst128 (inst128_out, D_SIX, T_count[2]);
  and inst129 (inst129_out, D_SEVEN, T_count[2]);
  and inst130 (inst130_out, D_SEVEN, T_count[4]);
  and inst131 (inst131_out, D_EIGHT, T_count[2]);
  and inst132 (inst132_out, D_EIGHT, T_count[8]);
  and inst134 (inst134_out, D_NINE, T_count[2]);
  and inst135 (inst135_out, D_NINE, T_count[4]);
  and inst136 (inst136_out, D_TEN, T_count[2]);
  and inst137 (inst137_out, D_TEN, T_count[8]);
  and inst138 (inst138_out, D_TEN, T_count[12]);
  and inst139 (inst139_out, D_TEN, T_count[16]);
  // AND2 inst140 has open pins: IN1=D_TEN, IN2=T_count[23], OUT=open
  and inst141 (inst141_out, D_NINE, T_count[10]);
  and inst142 (inst142_out, D_FIVE, T_count[4], Zero);
  and inst143 (inst143_out, D_SIX, T_count[4], Negative);
  and inst144 (inst144_out, D_SEVEN, T_count[6], Zero);
  DFF inst272 (.CLRN(inst41_out), .CLK(clk), .D(READY), .Q(READY_PREV));  // open: PRN
  not inst41 (inst41_out, areset);
  not inst269 (inst269_out, MEM_START);
  or inst149 (inst149_out, inst142_out, inst143_out, inst144_out, T_count[0]);
  and inst257 (inst257_out, D_ZERO, T_count[7]);
  and inst258 (inst258_out, D_ONE, T_count[7]);
  and inst259 (inst259_out, D_THREE, T_count[5]);
  and inst260 (inst260_out, D_EIGHT, T_count[11]);
  and inst261 (inst261_out, D_NINE, T_count[11]);
  and inst262 (inst262_out, D_TEN, T_count[17]);
  and inst187 (M_V, READY, inst269_out);
  DFF inst190 (.CLRN(not_areset), .CLK(clk), .D(inst264_result), .Q(inc_one_prev));  // open: PRN
  DFF inst191 (.CLRN(not_areset), .CLK(clk), .D(inst265_result), .Q(inc_two_prev));  // open: PRN
  or inst147 (inst147_out, inst130_out, inst131_out, inst132_out, inst200_out, inst134_out, inst135_out, inst136_out, inst137_out, inst138_out, inst139_out, 1'b0, inst141_out);
  not inst194 (not_areset, areset);
  or inst146 (inst146_out, inst118_out, inst119_out, inst120_out, inst121_out, inst122_out, inst123_out, inst124_out, inst125_out, inst126_out, inst127_out, inst128_out, inst129_out);
  and inst273 (MEM_START, READY_PREV, Start);
  or inst148 (load_AR, inst146_out, inst147_out, inst149_out);
  or inst263 (WEN, inst257_out, inst258_out, inst259_out, inst260_out, inst261_out, inst262_out);

  assign T_count[1] = load_IR;
endmodule
